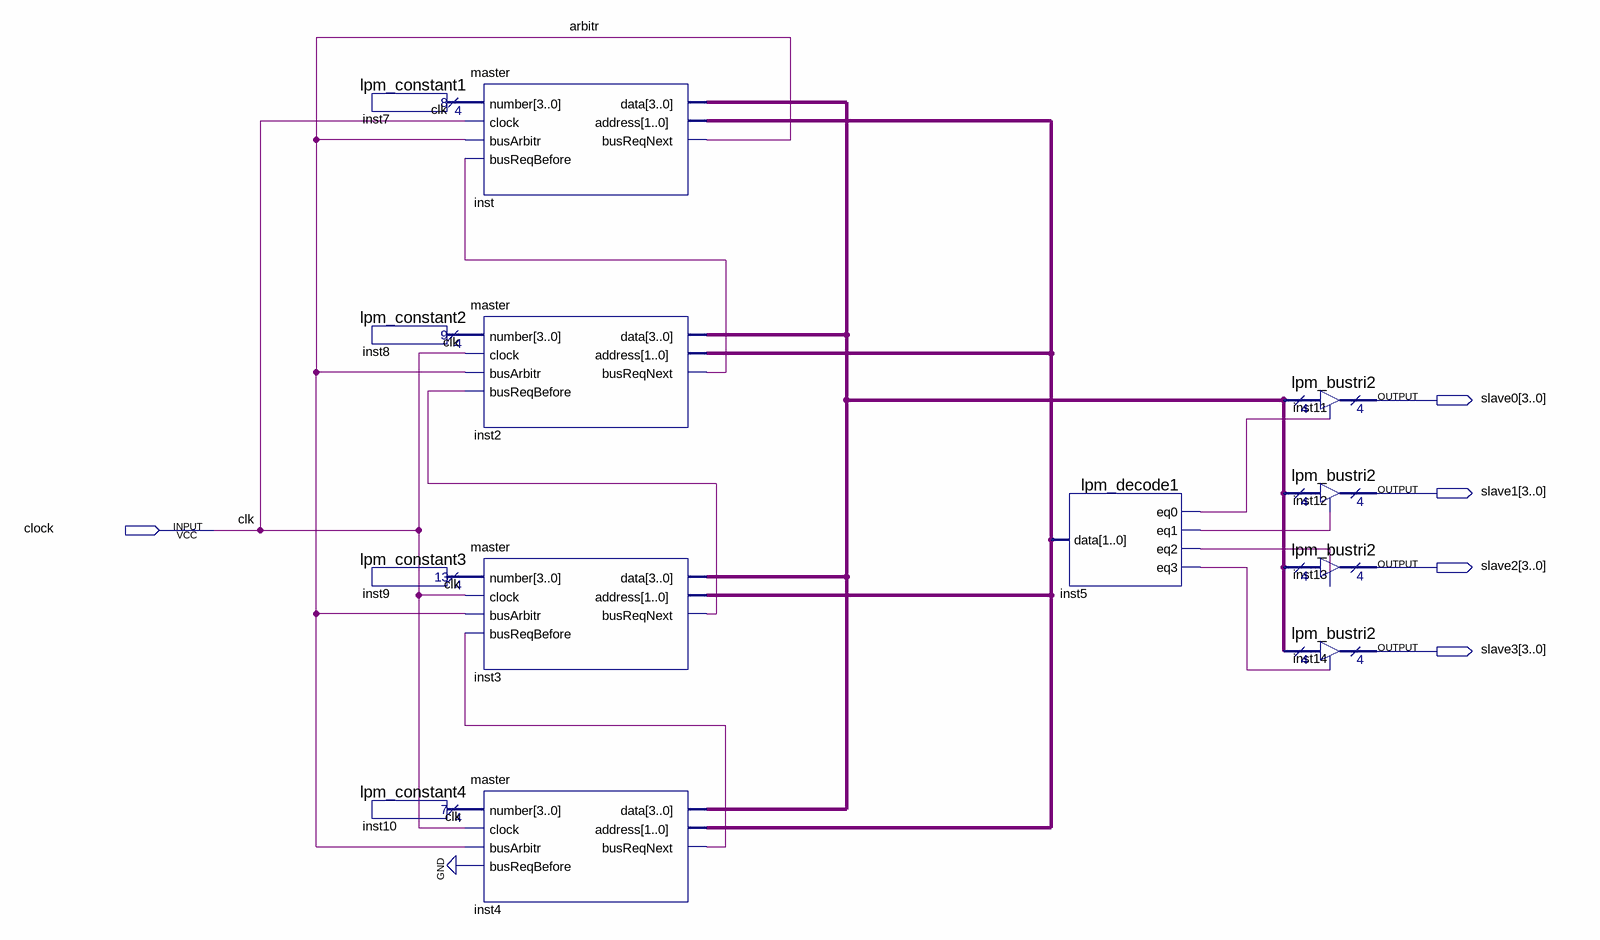
[diagram p0: schematic sheet]
// Quartus schematic arbbtr.bdf as structural Verilog: 13 symbols, 5 pins
module arbbtr (
  input  clock,
  output [3:0] slave0,
  output [3:0] slave1,
  output [3:0] slave2,
  output [3:0] slave3
);

  wire arbitr, inst2_busreqnext, inst3_busreqnext, inst4_busreqnext, inst5_eq0, inst5_eq1, inst5_eq2,
       inst5_eq3;
  wire [1:0] inst_address;
  wire [3:0] inst7_result, inst8_result, inst9_result, inst10_result, inst_data;

  lpm_constant1 inst7 (.result(inst7_result));
  lpm_constant2 inst8 (.result(inst8_result));
  lpm_constant3 inst9 (.result(inst9_result));
  lpm_constant4 inst10 (.result(inst10_result));
  master inst (
    .number(inst7_result), .clock(clock), .busArbitr(arbitr), .busReqBefore(inst2_busreqnext),
    .data(inst_data), .address(inst_address), .busReqNext(arbitr));
  master inst2 (
    .number(inst8_result), .clock(clock), .busArbitr(arbitr), .busReqBefore(inst3_busreqnext),
    .data(inst_data), .address(inst_address), .busReqNext(inst2_busreqnext));
  master inst3 (
    .number(inst9_result), .clock(clock), .busArbitr(arbitr), .busReqBefore(inst4_busreqnext),
    .data(inst_data), .address(inst_address), .busReqNext(inst3_busreqnext));
  master inst4 (
    .number(inst10_result), .clock(clock), .busArbitr(arbitr), .busReqBefore(1'b0), .data(inst_data),
    .address(inst_address), .busReqNext(inst4_busreqnext));
  lpm_decode1 inst5 (.data(inst_address), .eq0(inst5_eq0), .eq1(inst5_eq1), .eq2(inst5_eq2), .eq3(inst5_eq3));
  lpm_bustri2 inst11 (.enabledt(inst5_eq0), .data(inst_data), .tridata(slave0));
  lpm_bustri2 inst12 (.enabledt(inst5_eq1), .data(inst_data), .tridata(slave1));
  lpm_bustri2 inst13 (.enabledt(inst5_eq2), .data(inst_data), .tridata(slave2));
  lpm_bustri2 inst14 (.enabledt(inst5_eq3), .data(inst_data), .tridata(slave3));

  // Other names for the same wires on the sheet: clk = clock
endmodule
